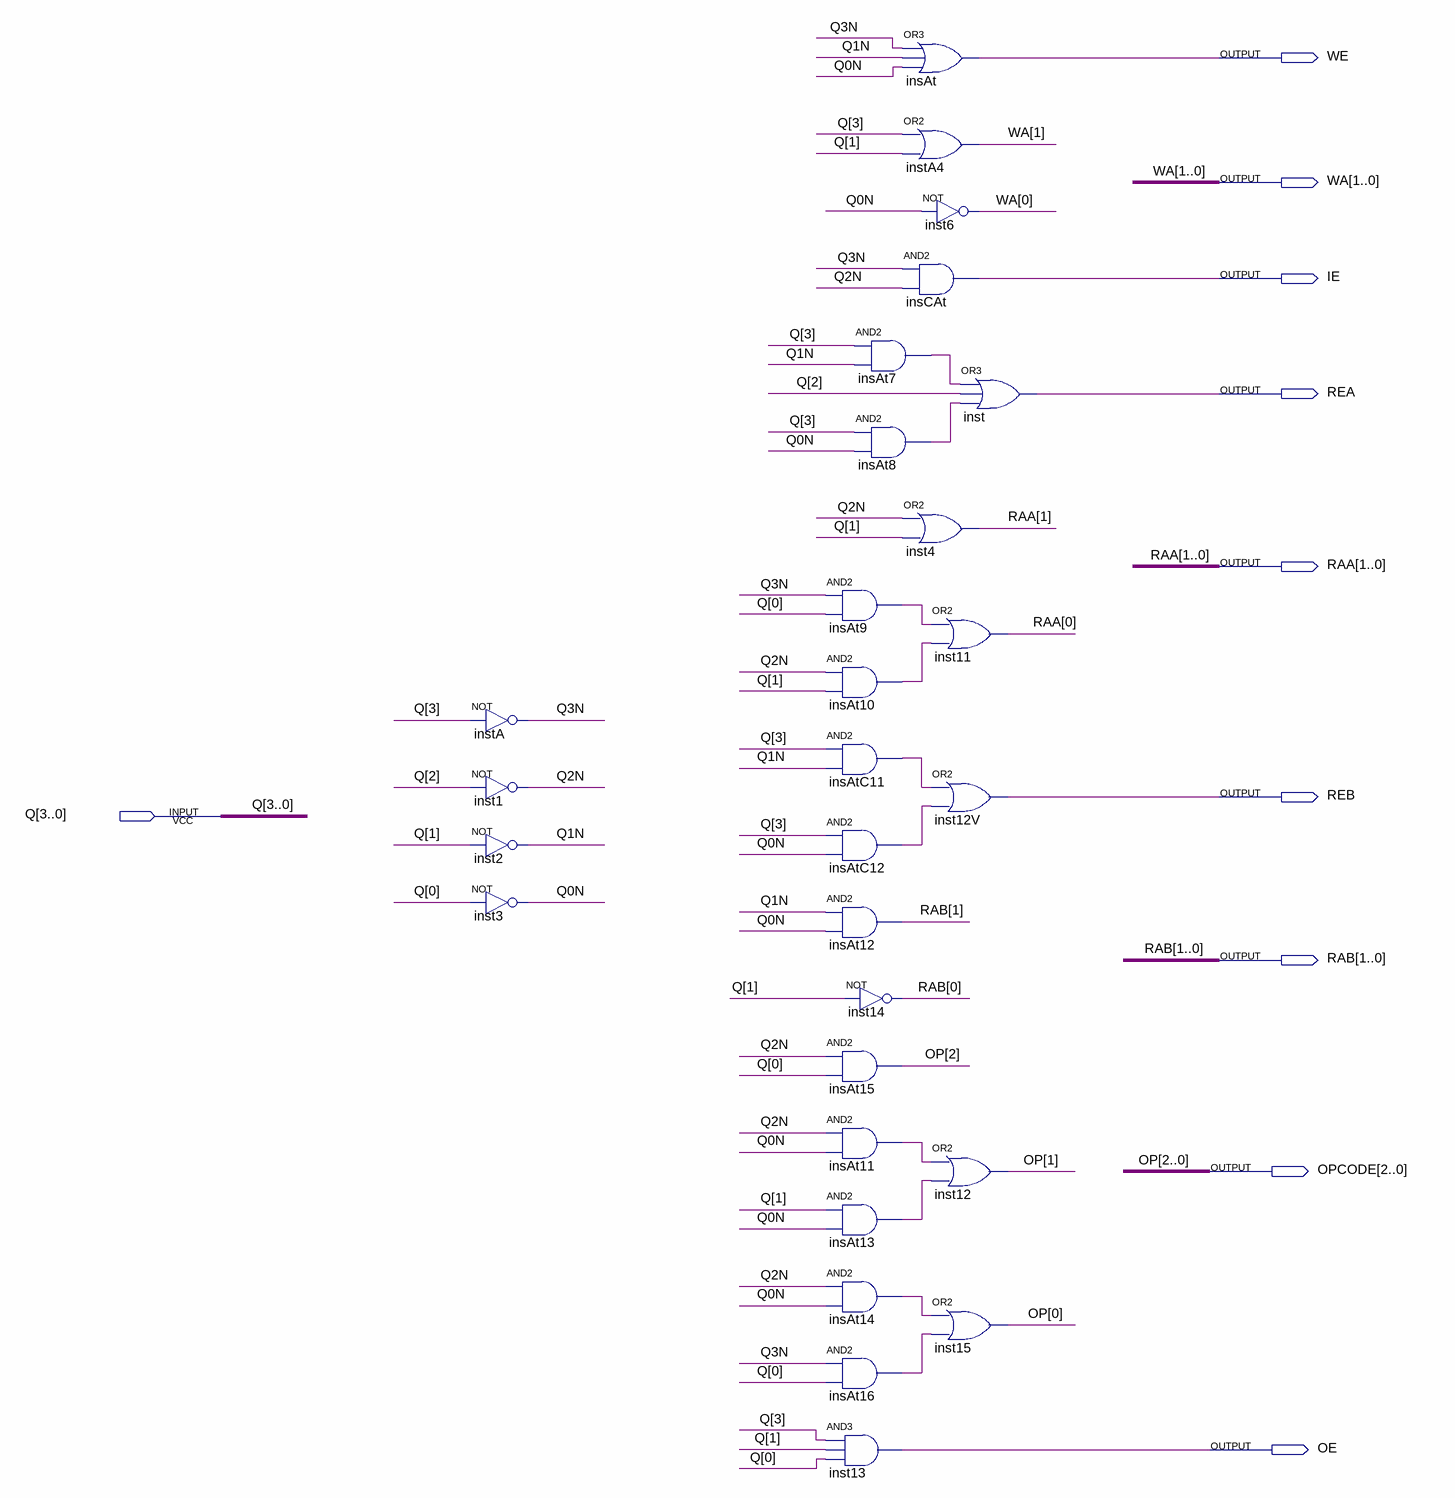
[diagram p0: schematic sheet]
// Quartus schematic OUTPUT.bdf as structural Verilog: 28 symbols, 10 pins
module OUTPUT (
  input  [3:0] Q,
  output WE,
  output [1:0] WA,
  output IE,
  output REA,
  output [1:0] RAA,
  output REB,
  output [1:0] RAB,
  output [2:0] OPCODE,
  output OE
);

  wire insAt7_out, insAt8_out, insAt9_out, insAt10_out, insAt11_out, insAt13_out, insAt14_out, insAt16_out,
       insAtC11_out, insAtC12_out, Q0N, Q1N, Q2N, Q3N;

  not instA (Q3N, Q[3]);
  not inst1 (Q2N, Q[2]);
  not inst2 (Q1N, Q[1]);
  not inst3 (Q0N, Q[0]);
  and insAt9 (insAt9_out, Q3N, Q[0]);
  and insAt10 (insAt10_out, Q2N, Q[1]);
  and insAtC11 (insAtC11_out, Q[3], Q1N);
  and insAtC12 (insAtC12_out, Q[3], Q0N);
  and insAt12 (RAB[1], Q1N, Q0N);
  not inst14 (RAB[0], Q[1]);
  and insAt15 (OPCODE[2], Q2N, Q[0]);
  and insAt11 (insAt11_out, Q2N, Q0N);
  and insAt13 (insAt13_out, Q[1], Q0N);
  and insAt14 (insAt14_out, Q2N, Q0N);
  and insAt16 (insAt16_out, Q3N, Q[0]);
  and inst13 (OE, Q[3], Q[1], Q[0]);
  or insAt (WE, Q3N, Q1N, Q0N);
  or instA4 (WA[1], Q[3], Q[1]);
  not inst6 (WA[0], Q0N);
  and insCAt (IE, Q3N, Q2N);
  and insAt7 (insAt7_out, Q[3], Q1N);
  and insAt8 (insAt8_out, Q[3], Q0N);
  or inst4 (RAA[1], Q2N, Q[1]);
  or inst (REA, insAt7_out, Q[2], insAt8_out);
  or inst11 (RAA[0], insAt9_out, insAt10_out);
  or inst12V (REB, insAtC11_out, insAtC12_out);
  or inst12 (OPCODE[1], insAt11_out, insAt13_out);
  or inst15 (OPCODE[0], insAt14_out, insAt16_out);

  // Other names for the same wires on the sheet: OP[2:0] = OPCODE
endmodule
